# EAGLE design freezeTimeManualRoute (EAGLE 7.1.0)
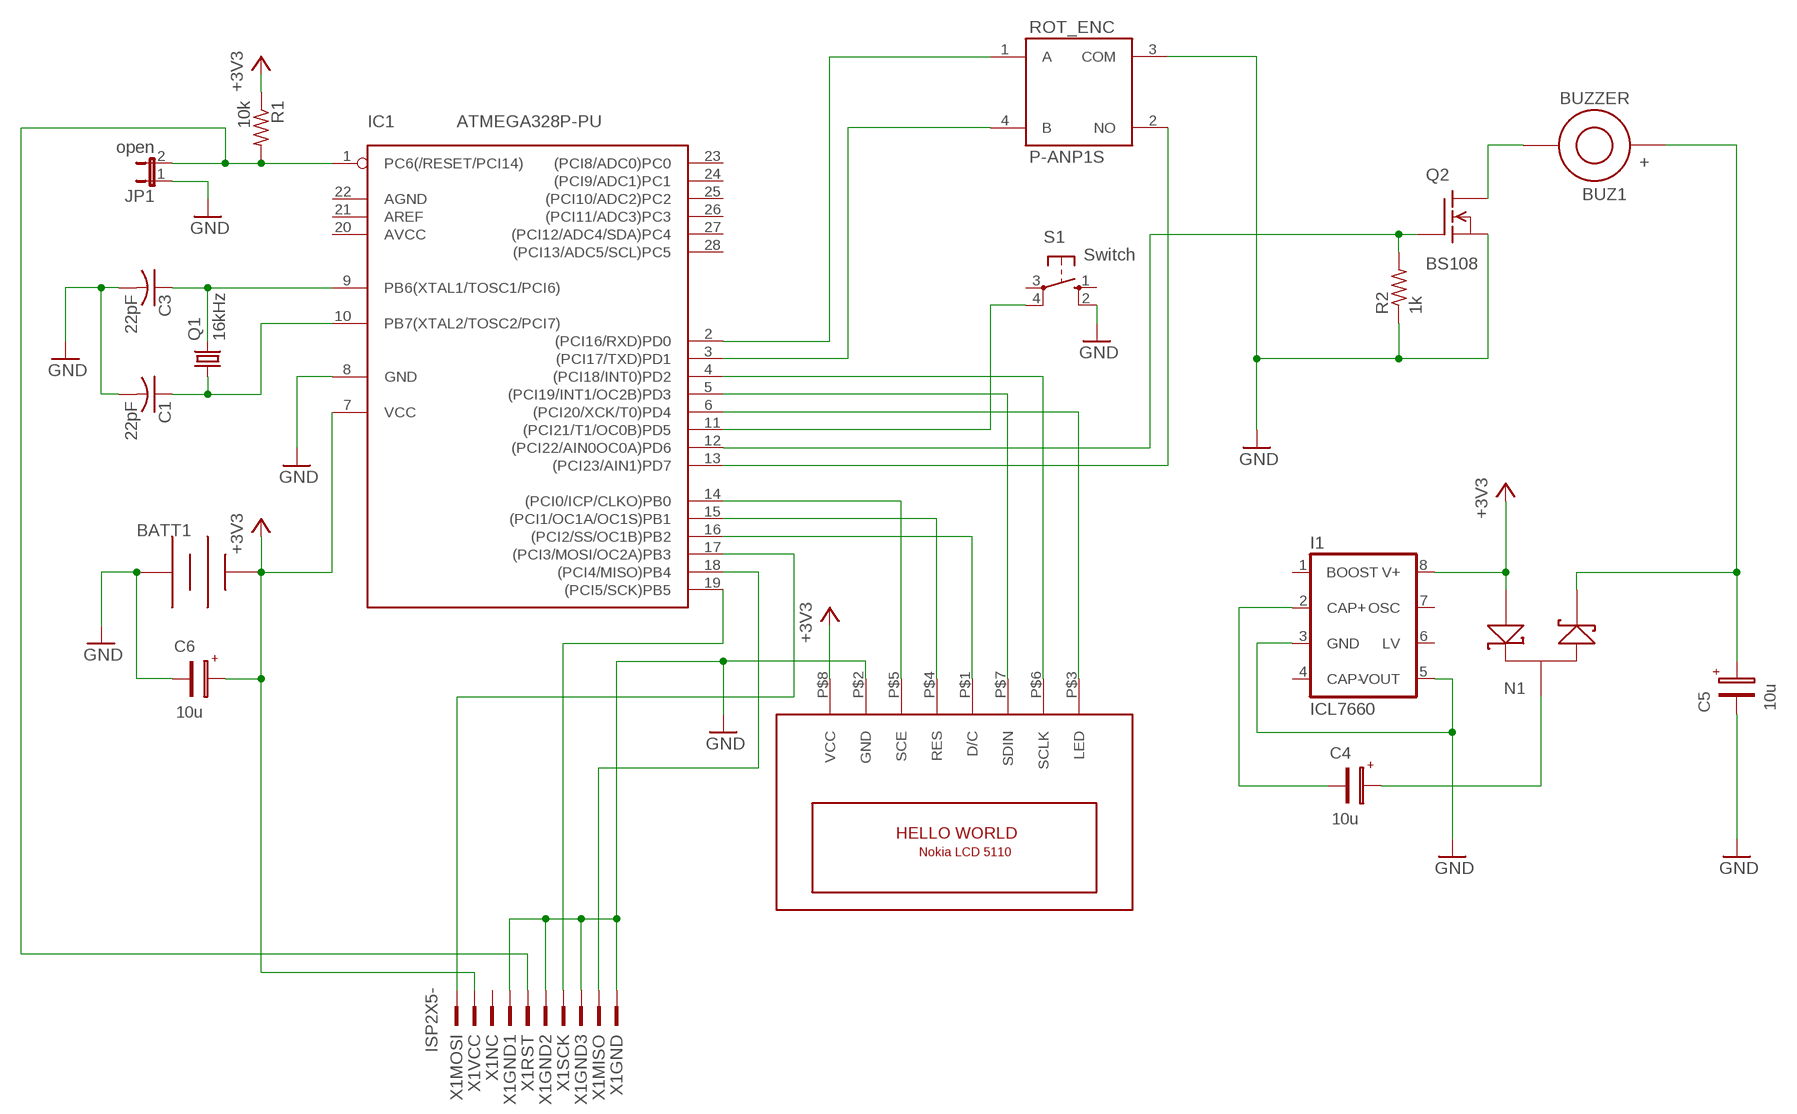
[diagram p0: schematic, sheet 1]

## Parts
BATT1  3VBATTERY  [BH241-3A]
BUZ1  BUZZER  [AL1210MTE-P5R]
C1  22pF  C-USC1206  [C1206]
C3  22pF  C-USC1206  [C1206]
C4  10u  C-TANCTS  [C/6032-28R]
C5  10u  C-TANCTS  [C/6032-28R]
C6  10u  C-TANCTS  [C/6032-28R]
I1  ICL7660  ICL7660S7660SCBA  [SO08]
IC1  ATMEGA328P-PU  ATMEGA168V-10P  [DIL28-3]
JP1  open  JP1E  [JP1]
LCD1  LCD_NOKIA5110  [LCM5110_W]
N1  BAT54S  BAT54SBAT54S  [SOT23]
Q1  16kHz  CRYSTALHC49U70  [HC49U70]
Q2  BS108  FQN1N50CI  [TO92-INLINE]
R1  10k  R-US_R1206  [R1206]
R2  1k  R-US_R1206  [R1206]
ROT_ENC  P-ANP1S  P-ANP1SP-ANP1S  [P-ANP1S]
S1  Switch  SPST_SWITCH  [TACTS-24N]
X1  ISP2X5-  [PAK100/2500-10]

## Nets
+3V3: BATT1.+ C6.+ I1.8(V+) IC1.7(VCC) LCD1.P$8(VCC) N1.1 R1.1 X1.2
GND: BATT1.- C1.2 C3.2 C5.- C6.- I1.3(GND) I1.5(VOUT) IC1.8(GND) JP1.1 LCD1.P$2(GND) Q2.3(S) R2.1 ROT_ENC.3(COM) S1.2(S1) X1.4 X1.6 X1.8 X1.10
N$1: C3.1 IC1.9(PB6(XTAL1/TOSC1/PCI6)) Q1.2
N$2: C1.1 IC1.10(PB7(XTAL2/TOSC2/PCI7)) Q1.1
N$3: IC1.13((PCI23/AIN1)PD7) ROT_ENC.2(NO)
N$4: IC1.1(PC6(/RESET/PCI14)) JP1.2 R1.2 X1.5
N$5: IC1.2((PCI16/RXD)PD0) ROT_ENC.1(A)
N$6: IC1.18((PCI4/MISO)PB4) X1.9
N$7: IC1.3((PCI17/TXD)PD1) ROT_ENC.4(B)
N$8: IC1.15((PCI1/OC1A/OC1S)PB1) LCD1.P$4(RES)
N$9: IC1.14((PCI0/ICP/CLKO)PB0) LCD1.P$5(SCE)
N$10: IC1.16((PCI2/SS/OC1B)PB2) LCD1.P$1(D/C)
N$11: IC1.17((PCI3/MOSI/OC2A)PB3) X1.1
N$12: IC1.11((PCI21/T1/OC0B)PD5) S1.4(P1)
N$13: IC1.6((PCI20/XCK/T0)PD4) LCD1.P$3(LED)
N$14: BUZ1.2 Q2.1(D)
N$15: IC1.19((PCI5/SCK)PB5) X1.7
N$16: IC1.12((PCI22/AIN0OC0A)PD6) Q2.2(G) R2.2
N$18: IC1.5((PCI19/INT1/OC2B)PD3) LCD1.P$7(SDIN)
N$19: IC1.4((PCI18/INT0)PD2) LCD1.P$6(SCLK)
N$20: C4.- I1.2(CAP+)
N$21: C4.+ N1.3
N$22: BUZ1.1(+) C5.+ N1.2
Unconnected: I1.1(BOOST) I1.4(CAP-) I1.6(LV) I1.7(OSC) IC1.20(AVCC) IC1.21(AREF) IC1.22(AGND) IC1.23((PCI8/ADC0)PC0) IC1.24((PCI9/ADC1)PC1) IC1.25((PCI10/ADC2)PC2) IC1.26((PCI11/ADC3)PC3) IC1.27((PCI12/ADC4/SDA)PC4) IC1.28((PCI13/ADC5/SCL)PC5) S1.1(S) S1.3(P) X1.3

## Library data of the parts
BATT1 = lisakovo:3VBATTERY: 3V battery - dual package
BUZ1 = lisakovo:BUZZER
C1 C3 = adafruit:C-US: CAPACITOR, American symbol
C4-C6 = lisakovo:C-TAN: Tantal capacitor
I1 = lisakovo:ICL7660S: ICL7660A DC-DC inverter / charge pump
IC1 = adafruit:ATMEGA168*P: MICROCONTROLLER 16 kBytes FLASH 1 kBytes SRAM 512 Bytes EEPROM USART 8-channel 10 bit ADC
JP1 = lisakovo:JP1E: JUMPER
LCD1 = lisakovo:LCD_NOKIA5110
N1 = lisakovo:BAT54S: BAT54S Schottky Barrier Diodes; GME: 920-103
Q1 = adafruit:CRYSTAL: CRYSTAL; OC_FARNELL: unknown; OC_NEWARK: unknown
Q2 = adafruit:FQN1N50C: N-Channel Enhancement MOSFET 500V, 0.4A, 6.0 Ohm
R1 R2 = adafruit:R-US_: RESISTOR, American symbol
ROT_ENC = lisakovo:P-ANP1S
S1 = lisakovo:SPST_SWITCH: SPST push button switch; GME: 631-400; MF: NINIGI
X1 = lisakovo:ISP2X5-: Arduino 2x5 ISP MLW10G; GME: 800-035; MF: 3M; MPN: 2510-6002UB; OC_FARNELL: 9838244; OC_NEWARK: 46F4725

## Net classes
0 default: width 0.381 mm, clearance 0.305 mm

## Board
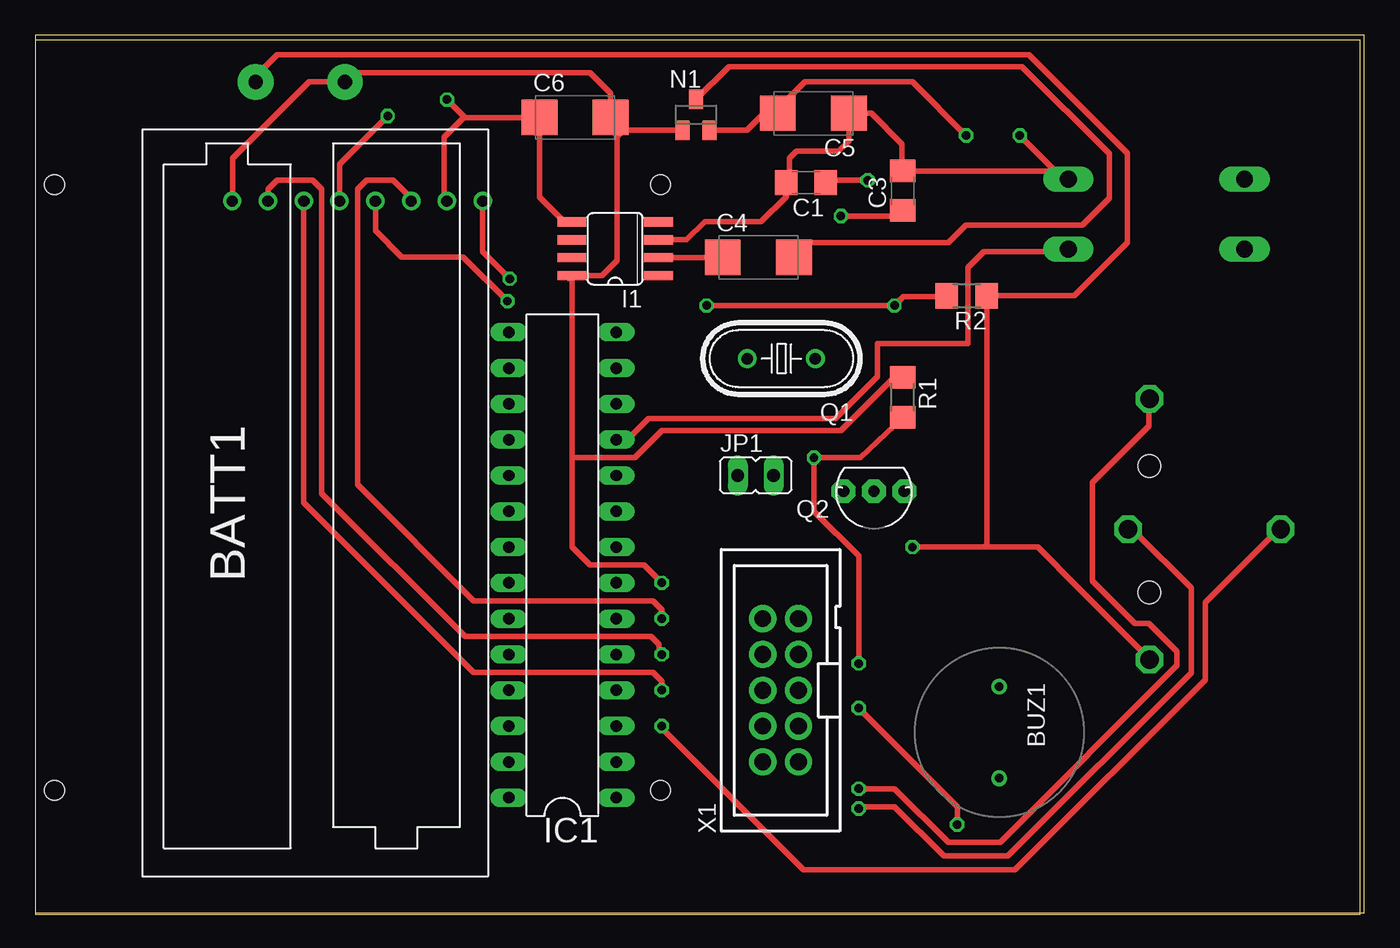
[diagram p1: board, top side]
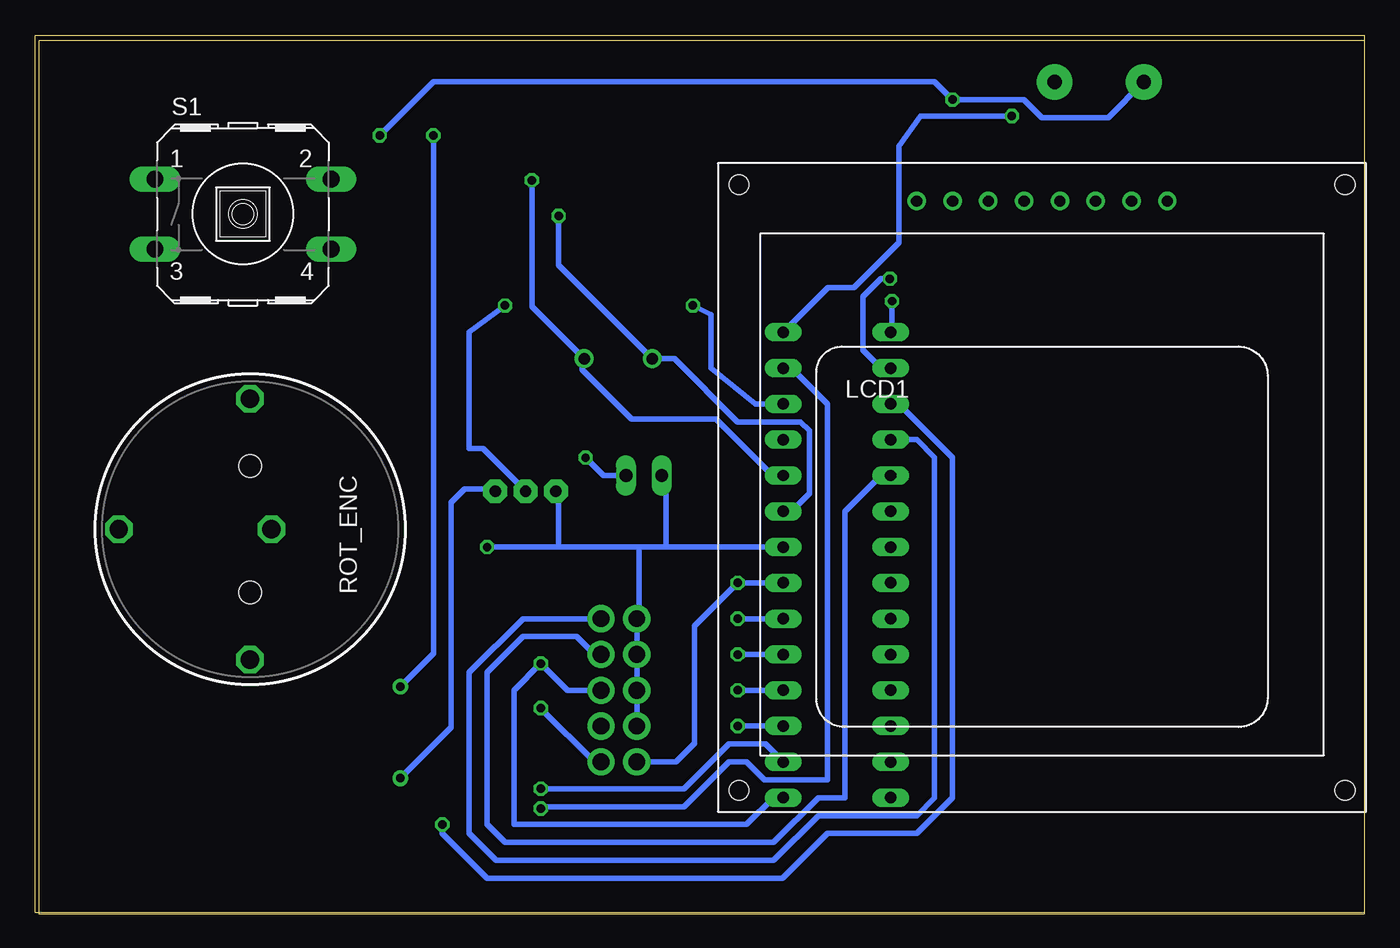
[diagram p2: board, bottom side, seen from below]

Size 94.28 x 62.26 mm. Coordinates in mm from the lower left corner, seen from the top.
Outline: 0,0 94.28,0 94.28,62.26 0,62.26 0,0
Copper layers (1*16): Top 0.035mm / dielectric 1.5mm / Bottom 0.035mm
Design rules "default *": minimum track width 10mil, minimum drill 0.6mm, track to track 12mil, track to pad 12mil, pad to pad 12mil, via to via 12mil, smd to smd 8mil, copper to edge 40mil, drill to drill 8mil, minimum pad ring 10mil, minimum via ring 8mil, stop-mask expansion 4mil, vias tented up to drill 0mil, thermal gap 10mil
Milling: 4 lines

### Footprints (pad centres in the part's own frame; a part is rotated, then mirrored left to right if it is on the bottom)
BH241-3A = drill 1 pad 2.54: + 56.365,-14.35; - 56.365,-8.015
AL1210MTE-P5R = drill 0.6: 1 -3.25,0; 2 3.25,0
C1206 = smd 1.6 x 1.8: 1 -1.4,0; 2 1.4,0
C/6032-28R = smd 2.55 x 2.5: + 2.525,0; - -2.525,0
SO08 = smd 0.66 x 2.032: 1 -1.905,-3.073; 2 -0.635,-3.073; 3 0.635,-3.073; 4 1.905,-3.073; 5 1.905,3.073; 6 0.635,3.073; 7 -0.635,3.073; 8 -1.905,3.073
DIL28-3 = drill 0.813 long: 1 -16.51,-3.81; 2 -13.97,-3.81; 3 -11.43,-3.81; 4 -8.89,-3.81; 5 -6.35,-3.81; 6 -3.81,-3.81; 7 -1.27,-3.81; 8 1.27,-3.81; 9 3.81,-3.81; 10 6.35,-3.81; 11 8.89,-3.81; 12 11.43,-3.81; 13 13.97,-3.81; 14 16.51,-3.81; 15 16.51,3.81; 16 13.97,3.81; 17 11.43,3.81; 18 8.89,3.81; 19 6.35,3.81; 20 3.81,3.81; 21 1.27,3.81; 22 -1.27,3.81; 23 -3.81,3.81; 24 -6.35,3.81; 25 -8.89,3.81; 26 -11.43,3.81; 27 -13.97,3.81; 28 -16.51,3.81
JP1 = drill 0.914 long: 1 0,-1.27; 2 0,1.27
LCM5110_W = drill 0.8: P$1 -8.89,20.32; P$2 -6.35,20.32; P$3 -3.81,20.32; P$4 -1.27,20.32; P$5 1.27,20.32; P$6 3.81,20.32; P$7 6.35,20.32; P$8 8.89,20.32 | hole 1.4: -21.5,21.5; -21.5,-21.5; 21.5,21.5; 21.5,-21.5
SOT23 = smd 1 x 1.4: 1 -0.95,-1.1; 2 0.95,-1.1; 3 0,1.1
HC49U70 = drill 0.813: 1 -2.413,0; 2 2.413,0
TO92-INLINE = drill 0.813 pad 1.676 octagon: 1 -2.159,0; 2 0,0; 3 2.159,0
R1206 = smd 1.6 x 1.803: 1 -1.422,0; 2 1.422,0
P-ANP1S = drill 1.3 octagon: 1 -9.26,0; 2 0,1.52; 3 9.26,0; 4 0,-9.31 | hole 1.6: -4.5,0; 4.5,0
TACTS-24N = drill 1.194 long: 1 -6.248,2.489; 2 6.248,2.489; 3 -6.248,-2.489; 4 6.248,-2.489
PAK100/2500-10 = drill 1.2 pad 1.93: 1 -5.08,-1.27; 2 -5.08,1.27; 3 -2.54,-1.27; 4 -2.54,1.27; 5 0,-1.27; 6 0,1.27; 7 2.54,-1.27; 8 2.54,1.27; 9 5.08,-1.27; 10 5.08,1.27

### Placement (x,y rotation side)
BATT1  7.62,2.58 90 top
BUZ1  68.39,12.79 270 top
C1  54.69,51.8 180 top
C3  61.54,51.22 90 top
C4  51.3,46.49 0 top
C5  55.2,56.72 180 top
C6  38.3,56.42 0 top
I1  41.14,47.11 90 top
IC1  37.41,24.67 90 top
JP1  51.11,31.02 270 top
LCD1  22.86,30.17 0 bottom
N1  46.88,56.61 0 top
Q1  52.94,39.31 180 top
Q2  59.5,29.91 180 top
R1  61.54,36.57 270 top
R2  66.08,43.77 180 top
ROT_ENC  79.05,27.21 270 bottom
S1  79.55,49.57 0 bottom
X1  52.88,15.78 90 top

### Tracks (layer width: path | path; a pad name or v marks a point on that pad's centre or on a via)
+3V3  (via drill 0.6)
  Top 0.406: 41.73,55.51 C6.+ 40.83,58.14 39.37,59.59 22.62,59.59 BATT1.+ 19.41,58.95 14,53.53 14,50.52 LCD1.P$8 | 41.73,55.51 N1.1 | 38.1,32.29 38.1,25.94 39.37,24.67 43.18,24.67 v44.45,23.4 | I1.8 37.85,44.99 | R1.1 60.95,37.99 57.15,34.2 44.45,34.2 42.55,32.29 38.1,32.29 | I1.8 40.22,45.2 41.27,46.26 41.27,55.05 41.73,55.51 | 38.1,32.29 38.1,45.17 I1.8
  Bottom 0.406: X1.2 48.83,10.7 47.5,12.03 47.5,20.35 v44.45,23.4 IC1.7
GND  (via drill 0.6)
  Top 0.406: 30.48,56.42 C6.- 35.77,50.76 37.5,49.03 38.05,49.03 I1.5 38.31,49.02 | 30.48,56.42 30.39,56.42 29,55.03 29,50.7 LCD1.P$2 | I1.3 46.22,47.75 47.5,49.03 51.5,49.03 53.29,50.82 C1.2 53.5,52.01 53.5,53.53 54,54.03 57,54.03 57.73,54.76 C5.- 59.31,56.72 61.5,54.53 61.5,52.66 C3.2 72.74,52.62 S1.2 72.94,52.06 v69.85,55.15 | v29.21,57.69 30.48,56.42 | ROT_ENC.3 79,18.03 74,23.03 74,23.06 71.12,25.94 67.31,25.94 | 67.31,25.94 v62.23,25.94 | 67.31,25.94 67.5,26.13 R2.1 73.72,43.77 77.47,47.53 77.47,53.88 70.48,60.87 17.14,60.87 15.88,59.59 15.88,59.19 BATT1.-
  Bottom 0.406: X1.4 X1.6 X1.8 X1.10 51.44,20.86 51.44,25.94 | BATT1.- 18.16,56.42 22.86,56.42 24.13,57.69 v29.21,57.69 30.48,58.96 66.04,58.96 v69.85,55.15 | IC1.8 49.53,25.94 | 49.53,25.94 51.44,25.94 | 51.44,25.94 57.15,25.94 | 57.15,25.94 v62.23,25.94 | JP1.1 49.53,31.02 49.53,25.94 | Q2.3 57.15,29.71 57.15,25.94
N$1  (via drill 0.6)
  Top 0.406: v57.15,49.44 61.16,49.44 C3.1
  Bottom 0.406: IC1.9 40.64,28.48 39.37,29.75 39.37,34.2 40.01,34.83 44.45,34.83 48.94,39.31 Q1.2 57.15,45.94 v57.15,49.44
N$2  (via drill 0.6)
  Top 0.406: v59.05,51.98 56.27,51.98 C1.1
  Bottom 0.406: IC1.10 41.99,31.02 46,35.03 52,35.03 55.5,38.53 55.5,39.16 Q1.1 59.05,43.02 v59.05,51.98
N$3  (via drill 0.6)
  Top 0.406: ROT_ENC.2 78,27.03 82,23.03 82,17.03 69,4.03 64.45,4.03 60.96,7.53 58.55,7.53 v58.42,7.39
  Bottom 0.406: IC1.13 40.64,38.64 38.1,36.1 38.1,9.43 42.55,9.43 43.81,10.7 45.09,10.7 48.26,7.53 58.28,7.53 v58.42,7.39
N$4  (via drill 0.6)
  Top 0.406: R1.2 58.53,32.29 v55.24,32.29 55.24,28.48 58.42,25.3 v58.42,17.69
  Bottom 0.406: v55.24,32.29 53.98,31.02 JP1.2 | IC1.1 41.91,8.16 43.81,6.25 60.33,6.25 60.33,15.78 v58.42,17.69 56.52,15.78 X1.5
N$5  (via drill 0.6)
  Top 0.406: ROT_ENC.1 79,36.03 79,34.53 75,30.53 75,23.53 78,20.53 79,20.53 81,18.53 81,17.53 68.45,4.99 64.77,4.99 60.96,8.79 v58.42,8.79
  Bottom 0.406: v58.42,8.79 48.26,8.79 45.09,11.97 42.49,11.97 IC1.2
N$6
  Bottom 0.406: X1.9 59.69,20.86 63.5,17.05 63.5,5.62 61.59,3.71 41.91,3.71 38.73,6.89 31.75,6.89 30.48,8.16 30.48,32.29 31.75,33.56 IC1.18
N$7  (via drill 0.6)
  Top 0.406: ROT_ENC.4 88,27.03 83,22.03 83,16.53 69.5,3.03 54.5,3.03 44.5,13.03 v44.45,13.24
  Bottom 0.406: v44.45,13.24 IC1.3
N$8  (via drill 0.6)
  Top 0.406: LCD1.P$4 24.13,48.4 26,46.53 30.36,46.53 v33.5,43.4
  Bottom 0.406: v33.5,43.4 33.5,41.28 IC1.15
N$9  (via drill 0.6)
  Top 0.406: v25,56.53 21.59,53.12 LCD1.P$5
  Bottom 0.406: v25,56.53 31.5,56.53 33,54.4 33,47.55 36.2,44.36 38.05,44.36 IC1.14
N$10  (via drill 0.6)
  Top 0.406: LCD1.P$1 31.75,46.9 v33.66,44.99
  Bottom 0.406: IC1.16 34.29,38.64 35.56,39.91 35.56,43.72 34.29,44.99 v33.66,44.99
N$11  (via drill 0.6)
  Top 0.406: v65.41,6.25 65.41,7.53 v58.42,14.51
  Bottom 0.406: IC1.17 33.02,36.1 29.21,32.29 29.21,8.16 31.75,5.62 38.1,5.62 41.27,2.44 62.23,2.44 65.41,5.62 v65.41,6.25 | X1.1 54.61,10.7 v58.42,14.51
N$12
  Top 0.406: IC1.11 41.25,33.53 42,33.53 43.52,35.05 56.77,35.05 59.75,38.03 59.75,40.4 66.17,40.4 66.17,45.76 67.31,46.9 73.12,46.9 S1.4
N$13  (via drill 0.6)
  Top 0.406: v44.45,20.86 44.45,21.5 43.81,22.13 31.11,22.13 22.86,30.39 22.86,51.34 23.5,51.98 25.4,51.98 26.67,50.7 LCD1.P$3
  Bottom 0.406: IC1.6 v44.45,20.86
N$14
  Bottom 0.406: BUZ1.2 64.77,13.15 64.77,29.12 63.81,30.07 61.66,30.07 Q2.1
N$15
  Bottom 0.406: X1.7 54.61,18.32 55.88,19.59 59.69,19.59 62.23,17.05 62.23,6.25 60.96,4.99 41.91,4.99 38.73,8.16 36.83,8.16 36.83,28.48 34.29,31.02 IC1.19
N$16  (via drill 0.6)
  Top 0.406: R2.2 64.6,43.72 61.59,43.72 v60.96,43.09 v47.62,43.09
  Bottom 0.406: v47.62,43.09 46.35,42.45 46.35,38.64 43.18,36.1 IC1.12 | Q2.2 62.52,32.93 63.5,32.93 63.5,41.18 v60.96,43.09
N$18  (via drill 0.6)
  Top 0.406: LCD1.P$7 16.51,51.34 17.14,51.98 19.68,51.98 20.32,51.34 20.32,29.75 30.48,19.59 43.69,19.59 44.25,19.03 44.25,18.39 v44.45,18.32
  Bottom 0.406: IC1.5 v44.45,18.32
N$19  (via drill 0.6)
  Top 0.406: v44.45,15.78 44.45,16.42 43.81,17.05 31.11,17.05 19.05,29.12 LCD1.P$6
  Bottom 0.406: IC1.4 v44.45,15.78
N$20
  Top 0.406: I1.2 48.76,46.48 C4.-
N$21
  Top 0.406: C4.+ 53.83,46.75 54.61,47.53 64.77,47.53 66.04,48.8 74.3,48.8 76.2,50.7 76.2,53.88 76.15,53.88 70,60.03 49.2,60.03 N1.3
N$22  (via drill 0.6)
  Top 0.406: N1.2 47.85,55.53 50.5,55.53 51.69,56.72 52.37,56.72 | 52.37,56.72 C5.+ | v66.04,55.15 62.23,58.96 54.61,58.96 52.37,56.72
  Bottom 0.406: v66.04,55.15 66.04,18.39 BUZ1.1